# Altium project Baskılı_Devre_Proje_2.PrjPcb
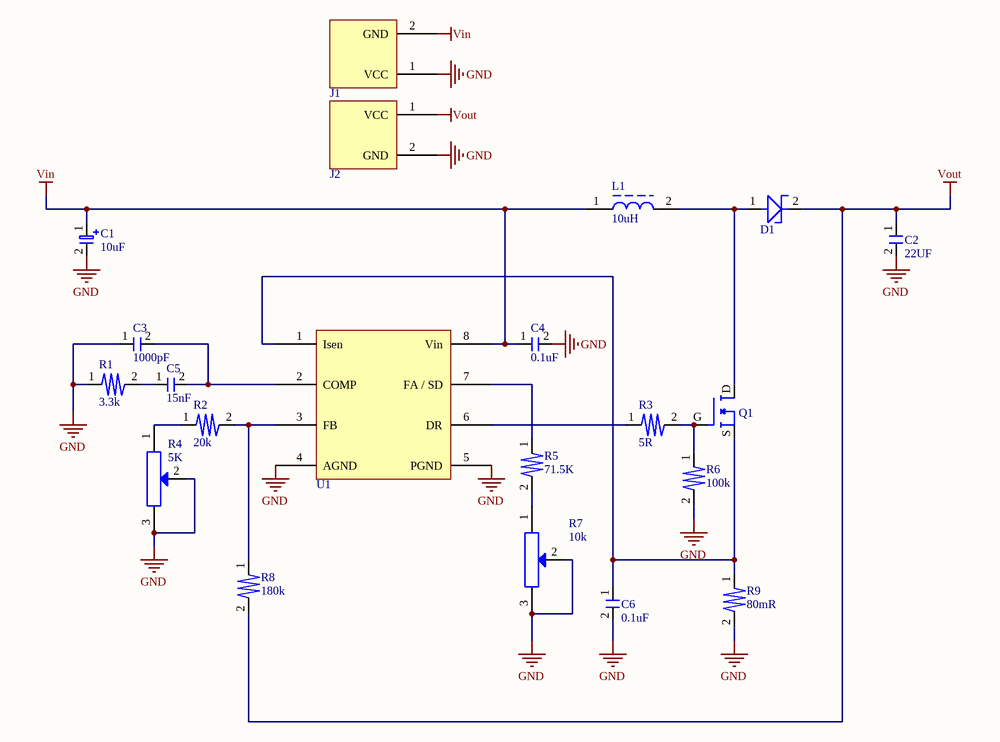
[diagram p0: Baskılı_Devre_Proje_2.SchDoc]
1 sheet, 21 parts. Net scope: global (net labels, ports and power ports of the same name join across sheets).
Board file: Baskılı_Devre_Proje_2.PcbDoc

## Sheet Baskılı_Devre_Proje_2.SchDoc
size A3; SheetNumber: 1; SheetTotal: 1

### Parts
C1  10uF  [Radial, Can - SMD]
C2  22UF  [0805 CAP SER]
C3  1000pF  [0805 CAP SER]
C4  0.1uF  [0603 CAP SER]
C5  15nF  [0603 CAP SER]
C6  0.1uF  [0603 CAP SER]
D1  Diode 20 V 5A Surface Mount SMC  [DO-214AB/SMC (Diode)]  (value not drawn)
J1  TERM BLK 2POS SIDE ENT 3.5MM PCB  [2P 3.5MM TERMİNAL BLOCK]  (value not drawn)
J2  TERM BLK 2POS SIDE ENT 3.5MM PCB  [2P 3.5MM TERMİNAL BLOCK]  (value not drawn)
L1  10uH  [SRN6045-100M]
Q1  N-Channel 30 V 4.4A (Ta) 1.25W (Ta) Surface Mount SOT-23  [SOT-23]  (value not drawn)
R1  3.3k  [0805 RES]
R2  20k  [0805 RES]
R3  5R  [0603 RES]
R4  5K  [TRİMMER]
R5  71.5K  [0805 RES]
R6  100k  [0805 RES]
R7  10k  [TRİMMER]
R8  180k  [0805 RES]
R9  80mR  [0805 RES]
U1  IC REG CTRLR MULT TOPOLOGY 8SOIC  [8-SOİC]  (value not drawn)

### Nets
GND: C1.2 C2.2 C3.1 C4.2 C6.2 J1.1(VCC) J2.2(GND) R1.1 R4.2 R4.3 R6.2 R7.2 R7.3 R9.2 U1.4(AGND) U1.5(PGND)
Vin: C1.1 C4.1 J1.2(GND) L1.1 U1.8(Vin)
Vout: C2.1 D1.2 J2.1(VCC) R8.2
NetC3_2: C3.2 C5.2 U1.2(COMP)
NetC5_1: C5.1 R1.2
NetC6_1: C6.1 Q1.S R9.1 U1.1(Isen)
NetD1_1: D1.1 L1.2 Q1.D
NetQ1_G: Q1.G R3.2 R6.1
NetR2_1: R2.1 R4.1
NetR2_2: R2.2 R8.1 U1.3(FB)
NetR3_1: R3.1 U1.6(DR)
NetR5_1: R5.1 U1.7(FA_/_SD)
NetR5_2: R5.2 R7.1

### Library data of the parts
C1 = CAP ALUM 10UF 20% 16V SMD: WCAP-ASLI Aluminum Electrolytic Capacitors; Manufacturer: Wurth Electronics; Manufacturer Part Number: 865080340001; Voltage Rating: 16V; Ripple Current: 80mA; Impedance: 2.2R; Tolerance: 20%; ESR (Equivalent Series Resistance): 1.66693R; Insulation Resistance: 5.33333MR; Leakage Current: 3uA; Supplier: Mouser; Supplier Part Number: 710-865080340001; RoHS: Yes; Category: Aluminum Electrolytic Capacitors; Stock: 90035; Pricing: 1=0,18, 10=0,18, 50=0,156, 100=0,135, 1000=0,1, 10000=0,099 (USD); Mounting Technology: Surface Mount; Case/Package: Radial; Min Operating Temperature: -55°C; Max Operating Temperature: 105°C; Package Quantity: 1; Packaging: Cut Tape; Ripple Current (AC): 80mA; Voltage Rating (DC): 16V; Value: 10uF; Series: WCAP-ASLI; Diameter: 4mm; Length: 5.5mm; Width: 4.3mm; Height: 5.5mm; Height - Seated (Max): 0.217inch; Lead Free: Lead Free; RoHS Compliant: Yes; Reach SVHC Compliant: Unknown; ComponentLink1URL: http://www.farnell.com/datasheets/1880118.pdf?src-supplier=Farnell; ComponentLink1Description: http://www.farnell.com/datasheets/1880118.pdf?src-supplier=Farnell; ComponentLink2URL: http://www.farnell.com/datasheets/1880118.pdf?src-supplier=Element14; ComponentLink2Description: http://www.farnell.com/datasheets/1880118.pdf?src-supplier=Element14; ComponentLink3URL: http://www.farnell.com/datasheets/1880118.pdf?src-supplier=Newark; ComponentLink3Description: http://www.farnell.com/datasheets/1880118.pdf?src-supplier=Newark; ComponentLink4URL: https://katalog.we-online.de/pbs/datasheet/865080340001.pdf?src-supplier=Digikey; ComponentLink4Description: https://katalog.we-online.de/pbs/datasheet/865080340001.pdf?src-supplier=Digikey
C2 = CAP CER 22UF 16V X5R 0805: Multilayer Ceramic Capacitor, 22 uF, 16 V, ± 10%, X5R, 0805 [2012 Metric]; Manufacturer: Samsung; Manufacturer Part Number: CL21A226KOQNNNG; Material: 4241ConductorMaterial; Voltage Rating (DC): 16V; Supplier: Mouser; Supplier Part Number: 187-CL21A226KOQNNNG; RoHS: Yes; Category: Ceramic Capacitors; Stock: 107435; Pricing: 1=0,31, 10=0,193, 50=0,193, 100=0,12, 1000=0,091, 10000=0,061 (USD); Height: 1.45mm; ComponentLink1URL: https://datasheet.ciiva.com/25727/cl21a226koqnnng-25727154.pdf?src-supplier=Digikey; ComponentLink1Description: https://datasheet.ciiva.com/25727/cl21a226koqnnng-25727154.pdf?src-supplier=Digikey
C3 = CAP CER 1000PF 16V X7R 0805: Multilayer Ceramic Capacitors MLCC - SMD/SMT 16V 1000pF X7R 0805 10%; Manufacturer: KEMET; Manufacturer Part Number: C0805C102K4RACTU; Material: 4241ConductorMaterial; Value: 1nF; Dissipation Factor: 5%; Temperature Coefficient: 30ppm/°C; Supplier: Mouser; Supplier Part Number: 80-C0805C102K4R; RoHS: Yes; Category: Ceramic Capacitors; Stock: 11009; Pricing: 1=0,29, 10=0,18, 50=0,18, 100=0,103, 1000=0,07, 10000=0,034 (USD); Mounting Technology: Surface Mount; Case/Package: 0805; Case Code (Metric): 2012; Case Code (Imperial): 0805; Dielectric Material: 4241ConductorMaterial; Min Operating Temperature: -55°C; Max Operating Temperature: 125°C; Package Quantity: 1; Voltage Rating: 16V; Tolerance: 10%; Packaging: Tape and Reel; Voltage Rating (DC): 16V; Dielectric: X7R; Termination: SMD/SMT; Series: C; Length: 0.079inch; Width: 0.049inch; Height: 0.78mm; Thickness: 0.035inch; Lead Pitch: 0.75mm; Reach SVHC Compliant: No; RoHS Compliant: Yes; ComponentLink1URL: http://www.farnell.com/datasheets/2746322.pdf?src-supplier=Farnell; ComponentLink1Description: http://www.farnell.com/datasheets/2746322.pdf?src-supplier=Farnell; ComponentLink2URL: http://www.mouser.com/ds/2/212/KEM_C1002_X7R_SMD-1102033.pdf?src-supplier=Mouser; ComponentLink2Description: http://www.mouser.com/ds/2/212/KEM_C1002_X7R_SMD-1102033.pdf?src-supplier=Mouser; ComponentLink3URL: http://www.farnell.com/datasheets/1828800.pdf?src-supplier=Newark; ComponentLink3Description: http://www.farnell.com/datasheets/1828800.pdf?src-supplier=Newark; ComponentLink4URL: https://datasheet.octopart.com/C0805C102K4RACTU-KEMET-datasheet-130256537.pdf?src-supplier=Element14; ComponentLink4Description: https://datasheet.octopart.com/C0805C102K4RACTU-KEMET-datasheet-130256537.pdf?src-supplier=Element14; ComponentLink5URL: https://api.kemet.com/component-edge/download/datasheet/C0805C102K4RACTU.pdf?src-supplier=Digikey; ComponentLink5Description: https://api.kemet.com/component-edge/download/datasheet/C0805C102K4RACTU.pdf?src-supplier=Digikey; ComponentLink6URL: http://www.farnell.com/datasheets/2746322.pdf?src-supplier=Newark; ComponentLink6Description: http://www.farnell.com/datasheets/2746322.pdf?src-supplier=Newark; ComponentLink7URL: http://capacitoredge.kemet.com/capedge2/DataSheet?pn=C0805C102K4RACTU&src-supplier=Avnet; ComponentLink7Description: http://capacitoredge.kemet.com/capedge2/DataSheet?pn=C0805C102K4RACTU&src-supplier=Avnet; ComponentLink8URL: https://datasheet.octopart.com/C0805C102K4RACTU-KEMET-datasheet-136484009.pdf?src-supplier=TME; ComponentLink8Description: https://datasheet.octopart.com/C0805C102K4RACTU-KEMET-datasheet-136484009.pdf?src-supplier=TME
C4 C6 = CAP CER 0.1UF 16V X7R 0603: 100nF ±10% 16V X7R 0603 Multilayer Ceramic Capacitors MLCC - SMD/SMT RoHS; Manufacturer: KEMET; Manufacturer Part Number: C0603C104K4RACTU; Dissipation Factor: 3.5%; Temperature Coefficient: 30ppm/°C; Supplier: Mouser; Supplier Part Number: 80-C0603C104K4R; RoHS: Yes; Category: Ceramic Capacitors; Stock: 434790; Pricing: 1=0,1, 10=0,021, 50=0,021, 100=0,02, 1000=0,018, 10000=0,013 (USD); Mounting Technology: Surface Mount,PCB; Case/Package: 0603; Case Code (Metric): 1608; Case Code (Imperial): 0603; Weight: 7.1E-05oz; Material: Ceramic; Min Operating Temperature: -55°C; Max Operating Temperature: 125°C; Value: 100nF; Tolerance: 10%; Dielectric: X7R; Package Quantity: 4000; Voltage Rating: 16V; Packaging: Tape and Reel; Voltage Rating (DC): 16V; Termination: SMD/SMT; Voltage: 16V; Series: SMD Comm X7R; Construction: Flat; Voltage Rating (AC): 16V; Length: 1.6mm; Width: 0.8mm; Height: 0.8mm; Lead Pitch: 0.7mm; Depth: 0.8mm; Radiation Hardening: No; Reach SVHC Compliant: No; RoHS Compliant: Yes; Lead Free: Lead Free; ComponentLink1URL: https://datasheet.ciiva.com/22749/kem-c1002-x7r-smd-22749657.pdf?src-supplier=Element14; ComponentLink1Description: https://datasheet.ciiva.com/22749/kem-c1002-x7r-smd-22749657.pdf?src-supplier=Element14; ComponentLink2URL: https://datasheet.ciiva.com/14589/70095383-14589014.pdf?src-supplier=Allied+Electronics; ComponentLink2Description: https://datasheet.ciiva.com/14589/70095383-14589014.pdf?src-supplier=Allied+Electronics; ComponentLink3URL: https://datasheet.ciiva.com/5413/kem-c1002-x7r-smd-5413791.pdf?src-supplier=Mouser; ComponentLink3Description: https://datasheet.ciiva.com/5413/kem-c1002-x7r-smd-5413791.pdf?src-supplier=Mouser; ComponentLink4URL: https://datasheet.ciiva.com/18192/getdatasheetpartid-330584-18192695.pdf?src-supplier=Verical; ComponentLink4Description: https://datasheet.ciiva.com/18192/getdatasheetpartid-330584-18192695.pdf?src-supplier=Verical
C5 = CAP CER 0603 15NF 16V X7R 10%: 0.015 µF ±10% 16V Ceramic Capacitor X7R 0603 (1608 Metric); Manufacturer: KEMET; Manufacturer Part Number: C0603C153K4RECTU; Supplier: Mouser; Supplier Part Number: 80-C0603C153K4RECTU; RoHS: Yes; Stock: 9235; Pricing: 1=0,1, 10=0,054, 50=0,054, 100=0,032, 1000=0,021, 10000=0,014 (USD); RoHS Compliant: Yes
D1 = DIODE SCHOTTKY 20V 5A SMC: VR=20V IF=5A 300pF; Manufacturer: Diodes; Manufacturer Part Number: B520C-13-F; Supplier: Mouser; Supplier Part Number: 621-B520C-F; RoHS: Yes; Category: Rectifier Diodes; Stock: 2672; Pricing: 1=0,61, 10=0,416, 50=0,416, 100=0,329, 1000=0,306, 10000=0,306 (USD); ComponentLink1URL: https://datasheet.ciiva.com/26949/getdatasheetpartid-213968-26949361.pdf?src-supplier=Verical; ComponentLink1Description: https://datasheet.ciiva.com/26949/getdatasheetpartid-213968-26949361.pdf?src-supplier=Verical; ComponentLink2URL: https://datasheet.ciiva.com/30479/0900766b8104afce-30479360.pdf?src-supplier=Rs; ComponentLink2Description: https://datasheet.ciiva.com/30479/0900766b8104afce-30479360.pdf?src-supplier=Rs; ComponentLink3URL: https://datasheet.ciiva.com/914/ds13012-914950.pdf?src-supplier=Digikey; ComponentLink3Description: https://datasheet.ciiva.com/914/ds13012-914950.pdf?src-supplier=Digikey; ComponentLink4URL: https://datasheet.ciiva.com/914/ds13012-914951.pdf?src-supplier=Digikey; ComponentLink4Description: https://datasheet.ciiva.com/914/ds13012-914951.pdf?src-supplier=Digikey; ComponentLink5URL: https://datasheet.ciiva.com/8301/ds13012-8301455.pdf?src-supplier=Avnet; ComponentLink5Description: https://datasheet.ciiva.com/8301/ds13012-8301455.pdf?src-supplier=Avnet; ComponentLink6URL: https://datasheet.ciiva.com/16210/ds13012-16210687.pdf?src-supplier=Future+Electronics; ComponentLink6Description: https://datasheet.ciiva.com/16210/ds13012-16210687.pdf?src-supplier=Future+Electronics
J1 J2 = TERM BLK 2POS SIDE ENT 3.5MM PCB: Conn Terminal Block 2 POS 3.5mm Solder ST Thru-Hole 10A Box; Manufacturer: Wurth Electronics; Manufacturer Part Number: 691214110002; Plating: Brass,Steel; Voltage Rating: 300V; Number of Contacts: 2; Number of Levels: 1; Wire Gauge (Max): 24AWG; Wire Gauge (Min): 16AWG; Stripping Length: -6mm; Supplier: Digikey; Supplier Part Number: 732-2747-ND; RoHS: Yes; Category: Terminal Blocks; Stock: 3392; Pricing: 1=0,79, 10=0,709, 50=0,612, 100=0,5481, 500=0,5166, 1400=0,4842 (USD); Mounting Technology: Through Hole; Contact Material: Brass; Color: Blue,Green; Contact Plating: Brass,Tin; Housing Material: PA66; Min Operating Temperature: -40°C; Max Operating Temperature: 105°C; Current Rating: 10A; Number of Positions Per Level: 2; Current: 10A; Voltage: 300V; Termination: Screw; Series: WR-TBL Series 2141; Number of Rows: 1NUMBER; Length: 7.4mm; Width: 7.9mm; Height: 12.2mm; Wire/Cable Gauge: 24AWG; Pitch: 3.5mm; RoHS Compliant: Yes; Reach SVHC Compliant: Unknown; ComponentLink1URL: https://datasheet.ciiva.com/824/6912141100xx-824001.pdf?src-supplier=Digikey; ComponentLink1Description: https://datasheet.ciiva.com/824/6912141100xx-824001.pdf?src-supplier=Digikey; ComponentLink2URL: https://datasheet.ciiva.com/48693/001088618-da-01-en-wr-tbl-terminal-block2141-691214110002-48693195.pdf?src-supplier=Conrad; ComponentLink2Description: https://datasheet.ciiva.com/48693/001088618-da-01-en-wr-tbl-terminal-block2141-691214110002-48693195.pdf?src-supplier=Conrad
L1 = FIXED IND 10UH 2.5A 58.6MOHM SMD: Inductor Power Semi-Shielded Wirewound 10uH 20% 100KHz 17Q-Factor Ferrite 2.5A 58.6mOhm DCR T/R; Manufacturer: Bourns; Supplier: Mouser; Supplier Part Number: 652-SRN6045-100M; Manufacturer Part Number: SRN6045-100M; RoHS: Yes; Category: Fixed Inductors; Stock: 21971; Pricing: 1=0,5, 10=0,357, 50=0,357, 100=0,3, 1000=0,212, 10000=0,191 (USD); ComponentLink1URL: https://datasheet.ciiva.com/11802/0900766b80fe1f3e-11802575.pdf?src-supplier=Rs; ComponentLink1Description: https://datasheet.ciiva.com/11802/0900766b80fe1f3e-11802575.pdf?src-supplier=Rs; ComponentLink2URL: https://datasheet.ciiva.com/28561/1875285-28561101.pdf?src-supplier=Element14; ComponentLink2Description: https://datasheet.ciiva.com/28561/1875285-28561101.pdf?src-supplier=Element14; ComponentLink3URL: https://datasheet.ciiva.com/17113/70231653-17113272.pdf?src-supplier=Allied+Electronics; ComponentLink3Description: https://datasheet.ciiva.com/17113/70231653-17113272.pdf?src-supplier=Allied+Electronics; ComponentLink4URL: https://datasheet.ciiva.com/7849/1875285-7849518.pdf?src-supplier=Element14; ComponentLink4Description: https://datasheet.ciiva.com/7849/1875285-7849518.pdf?src-supplier=Element14; ComponentLink5URL: https://datasheet.ciiva.com/6689/srn6045-6689370.pdf?src-supplier=Digikey; ComponentLink5Description: https://datasheet.ciiva.com/6689/srn6045-6689370.pdf?src-supplier=Digikey; ComponentLink6URL: https://datasheet.ciiva.com/6689/srn6045-6689372.pdf?src-supplier=Digikey; ComponentLink6Description: https://datasheet.ciiva.com/6689/srn6045-6689372.pdf?src-supplier=Digikey; ComponentLink7URL: https://datasheet.ciiva.com/6689/srn6045-6689374.pdf?src-supplier=Digikey; ComponentLink7Description: https://datasheet.ciiva.com/6689/srn6045-6689374.pdf?src-supplier=Digikey; ComponentLink8URL: https://datasheet.ciiva.com/8512/srn6045-8512981.pdf?src-supplier=Avnet; ComponentLink8Description: https://datasheet.ciiva.com/8512/srn6045-8512981.pdf?src-supplier=Avnet; ComponentLink9URL: https://datasheet.ciiva.com/48691/001056442-da-01-en-mag-abg-leist-ind-srn6045-100m-10uh-smd-48691818.pdf?src-supplier=Conrad; ComponentLink9Description: https://datasheet.ciiva.com/48691/001056442-da-01-en-mag-abg-leist-ind-srn6045-100m-10uh-smd-48691818.pdf?src-supplier=Conrad
Q1 = SOT-23, MOSFET: 1.25W/30V/4.4A/MOSFET/SOT-23/SINGLE N-ch; Manufacturer: Pan Jit; Manufacturer Part Number: PJA3406_R1_00001; Supplier: Mouser; Supplier Part Number: 241-PJA3406_R1_00001; RoHS: Yes; Stock: 438222; Pricing: 1=0,28, 10=0,189, 50=0,189, 100=0,098, 1000=0,088, 10000=0,059 (USD); RoHS Compliant: Yes
R1 = RES 3.3K OHM 1% 1/8W 0805: SMD Chip Resistor, 3.3 kOhm, ï¿½ 1%, 125 mW, 0805 [2012 Metric], Thick Film, General Purpose; Manufacturer: Yageo; Manufacturer Part Number: RC0805FR-073K3L; Value: 3.3kR; Voltage Rating: 150V; Temperature Coefficient: 100ppm/°C; Power Rating: 125mW; Supplier: Mouser; Supplier Part Number: 603-RC0805FR-073K3L; RoHS: Yes; Category: Chip SMD Resistors; Stock: 140040; Pricing: 1=0,1, 10=0,012, 50=0,012, 100=0,01, 1000=0,008, 10000=0,004 (USD); Case/Package: 0805; Case Code (Metric): 2012; Case Code (Imperial): 0805; Weight: 0.000194oz; Min Operating Temperature: -55°C; Max Operating Temperature: 155°C; Packaging: Tape and Reel; Tolerance: 1%; Package Quantity: 1; Resistor Type: Thick Film; Termination: SMD/SMT; Series: RC; Number of Terminations: 2; Max Power Dissipation: 125mW; Features: Moisture Resistant; Resistance Tolerance: 1%; Voltage Rating (AC): 150V; Length: 0.079inch; Width: 0.049inch; Height: 0.024inch; Lead Free: Lead Free; RoHS Compliant: Yes; Reach SVHC Compliant: Unknown; ComponentLink1URL: https://datasheet.ciiva.com/46447/444164-46447579.pdf?src-supplier=Element14; ComponentLink1Description: https://datasheet.ciiva.com/46447/444164-46447579.pdf?src-supplier=Element14; ComponentLink2URL: https://datasheet.ciiva.com/2457/pyu-r-int-thick-7-2457993.pdf?src-supplier=Digikey; ComponentLink2Description: https://datasheet.ciiva.com/2457/pyu-r-int-thick-7-2457993.pdf?src-supplier=Digikey; ComponentLink3URL: https://datasheet.ciiva.com/2457/pyu-r-int-thick-7-2457994.pdf?src-supplier=Digikey; ComponentLink3Description: https://datasheet.ciiva.com/2457/pyu-r-int-thick-7-2457994.pdf?src-supplier=Digikey; ComponentLink4URL: https://datasheet.ciiva.com/2457/pyu-r-int-thick-7-2457992.pdf?src-supplier=Digikey; ComponentLink4Description: https://datasheet.ciiva.com/2457/pyu-r-int-thick-7-2457992.pdf?src-supplier=Digikey; ComponentLink5URL: https://datasheet.ciiva.com/12577/rc0805-12577341.pdf?src-supplier=Mouser; ComponentLink5Description: https://datasheet.ciiva.com/12577/rc0805-12577341.pdf?src-supplier=Mouser; ComponentLink6URL: https://datasheet.ciiva.com/7941/444164-7941782.pdf?src-supplier=Element14; ComponentLink6Description: https://datasheet.ciiva.com/7941/444164-7941782.pdf?src-supplier=Element14; ComponentLink7URL: https://datasheet.ciiva.com/7941/444164-7941783.pdf?src-supplier=Element14; ComponentLink7Description: https://datasheet.ciiva.com/7941/444164-7941783.pdf?src-supplier=Element14; ComponentLink8URL: https://datasheet.ciiva.com/16747/rc0805-16747115.pdf?src-supplier=Future+Electronics; ComponentLink8Description: https://datasheet.ciiva.com/16747/rc0805-16747115.pdf?src-supplier=Future+Electronics
R2 = RES 20K OHM 1% 1/8W 0805: 125Mw Thick Film Resistors 100Ppm/ 1% 20K 0805 Chip Resistor Surface Mount Rohs; Manufacturer: Yageo; Manufacturer Part Number: RC0805FR-0720KL; Voltage Rating (DC): 150V; Supplier: Mouser; Supplier Part Number: 603-RC0805FR-0720KL; RoHS: Yes; Category: Chip SMD Resistors; Stock: 343670; Pricing: 1=0,1, 10=0,013, 50=0,013, 100=0,01, 1000=0,007, 10000=0,004 (USD); Pins: 2NUMBER; Lead Free: 5697LeadFree; ComponentLink1URL: https://datasheet.ciiva.com/46395/444164-46395127.pdf?src-supplier=Element14; ComponentLink1Description: https://datasheet.ciiva.com/46395/444164-46395127.pdf?src-supplier=Element14; ComponentLink2URL: https://datasheet.ciiva.com/12666/rc0805-12666938.pdf?src-supplier=Mouser; ComponentLink2Description: https://datasheet.ciiva.com/12666/rc0805-12666938.pdf?src-supplier=Mouser; ComponentLink3URL: https://datasheet.ciiva.com/15189/getdatasheetpartid-330251-15189927.pdf?src-supplier=Verical; ComponentLink3Description: https://datasheet.ciiva.com/15189/getdatasheetpartid-330251-15189927.pdf?src-supplier=Verical
R3 = RES 5 OHM 1% 0.4W 0603: Res Thin Film 0603 5 Ohm 1% 0.4W ±50ppm/C Pad SMD T/R Automotive; Manufacturer: Stackpole Electronics; Manufacturer Part Number: CSRT0603FT5R00; Power Rating: 400mW; Temperature Coefficient: 50ppm/°C; Supplier: Mouser; Supplier Part Number: 708-CSRT0603FT5R00; RoHS: Yes; Category: Chip SMD Resistors; Stock: 3224; Pricing: 1=0,22, 10=0,084, 50=0,084, 100=0,059, 1000=0,044, 10000=0,026 (USD); Case/Package: 345Case; Min Operating Temperature: -55°C; Max Operating Temperature: 155°C; Value: 5R; Tolerance: 1%; Height: 550um
R4 = TRIMMER 5K OHM 0.5W PC PIN TOP: Bourns 3296W-1-502LF 5K 10% Potentiometer Cermet Trimming 3/8" (3296W Series); Voltage Rating (AC): 300V; Supplier: Mouser; Supplier Part Number: 652-3296W-1-502LF; Manufacturer: Bourns; Manufacturer Part Number: 3296W-1-502LF; RoHS: Yes; Category: Variable Resistors and Potentiometers; Stock: 6667; Pricing: 1=2,05, 10=1,54, 50=1,54, 100=1,33, 1000=1,21, 10000=1,1 (USD); Color: 48Colour; Lead Free: 5697LeadFree
R5 = RES 71.5K OHM 1% 1/8W 0805: Res Thick Film 2.0 x 1.2 mm 71.5K Ohm 1% 0.125W(1/8W) 100ppm/ C Molded SMD Paper T/R; Manufacturer: Yageo; Manufacturer Part Number: RC0805FR-0771K5L; Voltage Rating (DC): 150V; Supplier: Mouser; Supplier Part Number: 603-RC0805FR-0771K5L; RoHS: Yes; Category: Chip SMD Resistors; Stock: 4864; Pricing: 1=0,1, 10=0,009, 50=0,009, 100=0,008, 1000=0,007, 10000=0,003 (USD); Lead Free: 5697LeadFree; ComponentLink1URL: https://datasheet.ciiva.com/2457/pyu-r-int-thick-7-2457794.pdf?src-supplier=Digikey; ComponentLink1Description: https://datasheet.ciiva.com/2457/pyu-r-int-thick-7-2457794.pdf?src-supplier=Digikey; ComponentLink2URL: https://datasheet.ciiva.com/2457/pyu-r-int-thick-7-2457795.pdf?src-supplier=Digikey; ComponentLink2Description: https://datasheet.ciiva.com/2457/pyu-r-int-thick-7-2457795.pdf?src-supplier=Digikey; ComponentLink3URL: https://datasheet.ciiva.com/2457/pyu-r-int-thick-7-2457796.pdf?src-supplier=Digikey; ComponentLink3Description: https://datasheet.ciiva.com/2457/pyu-r-int-thick-7-2457796.pdf?src-supplier=Digikey
R6 = RES 100K OHM 1% 1/8W 0805: SMD Chip Resistor, 100 kOhm, ï¿½ 1%, 125 mW, 0805 [2012 Metric], Thick Film, General Purpose; Manufacturer: Yageo; Manufacturer Part Number: RC0805FR-07100KL; Value: 100kR; Power Rating: 125mW; Voltage Rating: 150V; Temperature Coefficient: 100ppm/°C; Supplier: Mouser; Supplier Part Number: 603-RC0805FR-07100KL; RoHS: Yes; Category: Chip SMD Resistors; Stock: 405732; Pricing: 1=0,1, 10=0,014, 50=0,014, 100=0,011, 1000=0,009, 10000=0,003 (USD); Case/Package: 0805; Pins: 2; Case Code (Metric): 2012; Case Code (Imperial): 0805; Min Operating Temperature: -55°C; Max Operating Temperature: 155°C; Packaging: Tape and Reel; Resistor Type: Thick Film; Tolerance: 1%; Voltage Rating (DC): 150V; Package Quantity: 1; Termination: SMD/SMT; Series: RC; Number of Terminations: 2; Max Power Dissipation: 125mW; Features: Moisture Resistant; Construction: Rectangular; Resistance Tolerance: 1%; Technology: THICK FILM; Voltage Rating (AC): 150V; Length: 0.079inch; Width: 0.049inch; Height: 0.024inch; Depth: 1.25mm; Lead Pitch: 0.4mm; RoHS Compliant: Yes; Lead Free: 5697LeadFree; Reach SVHC Compliant: Unknown; Military Standard: Not; ComponentLink1URL: https://datasheet.ciiva.com/11808/0900766b8106beab-11808858.pdf?src-supplier=Rs; ComponentLink1Description: https://datasheet.ciiva.com/11808/0900766b8106beab-11808858.pdf?src-supplier=Rs; ComponentLink2URL: https://datasheet.ciiva.com/7941/1686128-7941677.pdf?src-supplier=Element14; ComponentLink2Description: https://datasheet.ciiva.com/7941/1686128-7941677.pdf?src-supplier=Element14; ComponentLink3URL: https://datasheet.ciiva.com/7660/38627-7660796.pdf?src-supplier=Element14; ComponentLink3Description: https://datasheet.ciiva.com/7660/38627-7660796.pdf?src-supplier=Element14; ComponentLink4URL: https://datasheet.ciiva.com/22747/444164-22747534.pdf?src-supplier=Element14; ComponentLink4Description: https://datasheet.ciiva.com/22747/444164-22747534.pdf?src-supplier=Element14; ComponentLink5URL: https://datasheet.ciiva.com/2457/pyu-r-int-thick-7-2457018.pdf?src-supplier=Digikey; ComponentLink5Description: https://datasheet.ciiva.com/2457/pyu-r-int-thick-7-2457018.pdf?src-supplier=Digikey; ComponentLink6URL: https://datasheet.ciiva.com/2457/pyu-r-int-thick-7-2457019.pdf?src-supplier=Digikey; ComponentLink6Description: https://datasheet.ciiva.com/2457/pyu-r-int-thick-7-2457019.pdf?src-supplier=Digikey; ComponentLink7URL: https://datasheet.ciiva.com/2457/pyu-r-int-thick-7-2457017.pdf?src-supplier=Digikey; ComponentLink7Description: https://datasheet.ciiva.com/2457/pyu-r-int-thick-7-2457017.pdf?src-supplier=Digikey; ComponentLink8URL: https://datasheet.ciiva.com/12667/rc0805-12667001.pdf?src-supplier=Mouser; ComponentLink8Description: https://datasheet.ciiva.com/12667/rc0805-12667001.pdf?src-supplier=Mouser; ComponentLink9URL: https://datasheet.ciiva.com/7941/1697719-7941676.pdf?src-supplier=Element14; ComponentLink9Description: https://datasheet.ciiva.com/7941/1697719-7941676.pdf?src-supplier=Element14; ComponentLink10URL: https://datasheet.ciiva.com/7941/1697719-7941678.pdf?src-supplier=Element14; ComponentLink10Description: https://datasheet.ciiva.com/7941/1697719-7941678.pdf?src-supplier=Element14; ComponentLink11URL: https://datasheet.ciiva.com/16747/rc0805-16747226.pdf?src-supplier=Future+Electronics; ComponentLink11Description: https://datasheet.ciiva.com/16747/rc0805-16747226.pdf?src-supplier=Future+Electronics
R7 = TRIMMER 10K OHM 0.5W PC PIN TOP: 1 kOhms .5W, 1/2W PC Pins Through Hole Trimmer Potentiometer Cermet 25. Turn Top Adjustment; Manufacturer: Bourns; Manufacturer Part Number: 3296W-1-103LF; Power Rating: 500mW; Value: 10kR; Tolerance: 10%; Number of Turns: 25; Temperature Coefficient: 100ppm/°C; Insulation Resistance: 1GR; Voltage Rating (AC): 300V; Supplier: Mouser; Supplier Part Number: 652-3296W-1-103LF; RoHS: Yes; Category: Variable Resistors and Potentiometers; Stock: 1582; Pricing: 1=2,44, 10=1,85, 50=1,85, 100=1,46, 1000=1,24, 10000=1,1 (USD); Mounting Technology: Through Hole,PCB; Case/Package: 345Case; Weight: 0.03oz; Color: 48Colour; Case Code (Imperial): 3202CaseCodeImperial; Case Code (Metric): 3657CaseCodeMetric; Min Operating Temperature: -55°C; Max Operating Temperature: 125°C; Packaging: Rail/Tube; Termination: Pin; Taper: Linear; Resistor Type: Cermet; Max Power Dissipation: 500mW; Series: 3296; Technology: CERMET; Resistance Tolerance: 10%; Length: 9.53mm; Width: 9.53mm; Height: 11.55mm; Depth: 4.83mm; Radiation Hardening: No; Reach SVHC Compliant: No; Military Standard: Not; RoHS Compliant: Yes; Lead Free: 5697LeadFree
R8 = RES 180K OHM 1% 1/8W 0805: Conn Shrouded Header (4 Sides) HDR 6 POS 2.5mm Solder ST Top Entry Thru-Hole SPOX Bag; Manufacturer: TE Connectivity Passive Product; Manufacturer Part Number: CRGCQ0805F180K; Plating: Tin; Contact Resistance: 20mR; Current Rating: 3A; Voltage Rating: 250V; Number of Positions: 6; Gender: Male; Number of Circuits: 5; Glow Wire Compliant: Non-compliant; Supplier: Mouser; Supplier Part Number: CRGCQ0805F180K; RoHS: Yes; Category: Headers and Wire Housings; Stock: 10344; Pricing: 1=0,25, 10=0,207, 50=0,203, 100=0,17, 1000=0,138, 10000=0,135 (USD); Mounting Technology: Through Hole; Contact Plating: Tin,Copper; Contact Material: Brass; Housing Material: Nylon; Min Operating Temperature: -40°C; Max Operating Temperature: 105°C; Package Quantity: 1; Number of Rows: 1; Packaging: Bulk; Termination: Solder; Number of Contacts: 6; Orientation: Straight; Voltage Rating (DC): 250V; Series: SPOX™ 5267; Contact Type: Male Pin; Pitch: 2.5mm; Contact Mating Length: 0.138inch; Radiation Hardening: No; Lead Free: Lead Free; RoHS Compliant: Yes; Reach SVHC Compliant: Unknown; ComponentLink1URL: https://datasheet.ciiva.com/7167/1865032-7167319.pdf?src-supplier=Newark; ComponentLink1Description: https://datasheet.ciiva.com/7167/1865032-7167319.pdf?src-supplier=Newark
R9 = RES 0.08 OHM 5% 1/8W 0805: Low Ohmic Chip Resistor Thick Film 0805 80mOhm 5% Paper T/R; Manufacturer: Yageo; Manufacturer Part Number: RL0805JR-070R08L; Max Power Dissipation: 125mW; Temperature Coefficient: 1000ppm/°C; Supplier: Mouser; Supplier Part Number: 603-RL0805JR-070R08L; RoHS: Yes; Category: Chip SMD Resistors; Stock: 4740; Pricing: 1=0,16, 10=0,119, 50=0,095, 100=0,084, 1000=0,061, 10000=0,036 (USD); Case/Package: 0805; Min Operating Temperature: -55°C; Max Operating Temperature: 155°C; Packaging: Tape and Reel; Value: 80mR; Number of Terminations: 2; Tolerance: 5%; Features: Moisture Resistant; Series: RL; Length: 0.079inch; Width: 0.049inch; Height: 0.024inch; ComponentLink1URL: http://www.mouser.com/ds/2/447/PYu-RL_521_RoHS_L_5-2927.pdf?src-supplier=Mouser; ComponentLink1Description: http://www.mouser.com/ds/2/447/PYu-RL_521_RoHS_L_5-2927.pdf?src-supplier=Mouser; ComponentLink2URL: http://www.yageo.com/documents/recent/PYu-RL_Group_521_RoHS_L_2.pdf?src-supplier=Digikey; ComponentLink2Description: http://www.yageo.com/documents/recent/PYu-RL_Group_521_RoHS_L_2.pdf?src-supplier=Digikey
U1 = LM3478MAX/NOPB: Manufacturer: TI National Semiconductor; Supplier: Mouser; Supplier Part Number: 926-LM3478MAX/NOPB; Manufacturer Part Number: LM3478MAX/NOPB; RoHS: Yes; Category: Voltage Regulators - Switching; Stock: 2561; Pricing: 1=2,34, 10=1,74, 50=1,59, 100=1,42, 1000=1,26, 10000=1,15 (USD); ComponentLink1URL: https://datasheet.ciiva.com/2021/lm3478-2021522.pdf?src-supplier=Digikey; ComponentLink1Description: https://datasheet.ciiva.com/2021/lm3478-2021522.pdf?src-supplier=Digikey